# EAGLE design Trace_antenna_final_RFID_v10 (EAGLE 9.6.2)
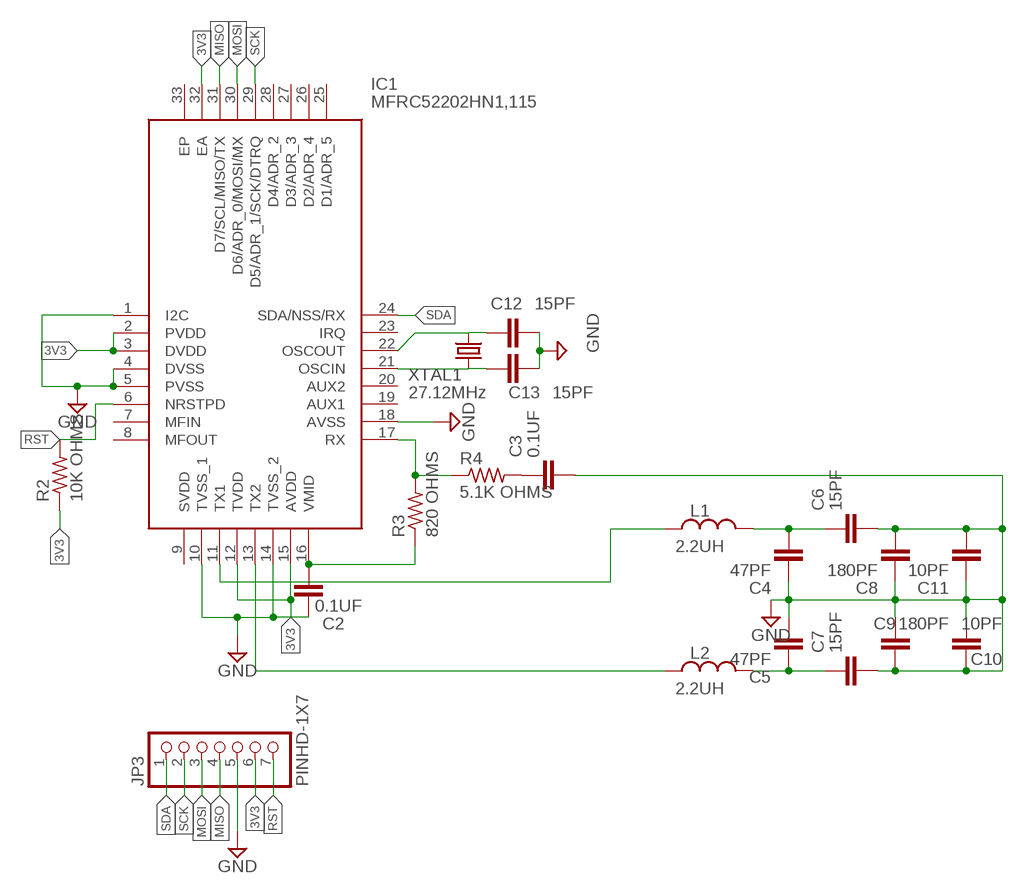
[diagram p0: schematic, sheet 1]

## Parts
C2  0.1UF  C_CHIP-0805(2012-METRIC)  [CAPC2012X110]
C3  0.1UF  C_CHIP-0805(2012-METRIC)  [CAPC2012X110]
C4  47PF  C_CHIP-0805(2012-METRIC)  [CAPC2012X110]
C5  47PF  C_CHIP-0805(2012-METRIC)  [CAPC2012X110]
C6  15PF  C_CHIP-0805(2012-METRIC)  [CAPC2012X110]
C7  15PF  C_CHIP-0805(2012-METRIC)  [CAPC2012X110]
C8  180PF  C_CHIP-0805(2012-METRIC)  [CAPC2012X110]
C9  180PF  C_CHIP-0805(2012-METRIC)  [CAPC2012X110]
C10  10PF  C_CHIP-0805(2012-METRIC)  [CAPC2012X110]
C11  10PF  C_CHIP-0805(2012-METRIC)  [CAPC2012X110]
C12  15PF  C_CHIP-0805(2012-METRIC)  [CAPC2012X110]
C13  15PF  C_CHIP-0805(2012-METRIC)  [CAPC2012X110]
IC1  MFRC52202HN1,115  [QFN50P500X500X100-33N]
JP3  PINHD-1X7  [1X07]
L1  2.2UH  L_CHIP-0805(2012-METRIC)  [INDC2009X120]
L2  2.2UH  L_CHIP-0805(2012-METRIC)  [INDC2009X120]
R2  10K OHMS  R-US_CHIP-0805(2012-METRIC)  [RESC2012X65]
R3  820 OHMS  R-US_CHIP-0805(2012-METRIC)  [RESC2012X65]
R4  5.1K OHMS  R-US_CHIP-0805(2012-METRIC)  [RESC2012X65]
XTAL1  27.12MHz  CRYSTAL_HC49-11.5L  [XTALRR488W45L1150T500H350B]

## Nets
3V3: IC1.2(PVDD) IC1.3(DVDD) IC1.12(TVDD) IC1.15(AVDD) IC1.32(EA) JP3.6 R2.1
GND: C2.1 C3.2 C4.1 C5.2 C6.2 C7.2 C8.1 C8.2 C9.1 C9.2 C10.1 C10.2 C11.1 C11.2 C12.2 C13.2 IC1.1(I2C) IC1.4(DVSS) IC1.5(PVSS) IC1.10(TVSS_1) IC1.14(TVSS_2) IC1.18(AVSS) JP3.5
MISO: IC1.31(D7/SCL/MISO/TX) JP3.4
MOSI: IC1.30(D6/ADR_0/MOSI/MX) JP3.3
N$1: C2.2 IC1.16(VMID) R3.1
N$2: IC1.11(TX1) L1.1
N$3: C12.1 IC1.22(OSCOUT) XTAL1.2
N$4: C13.1 IC1.21(OSCIN) XTAL1.1
N$5: C4.2 C6.1 L1.2
N$6: IC1.17(RX) R3.2 R4.1
N$7: IC1.13(TX2) L2.1
N$8: C5.1 C7.1 L2.2
N$9: C3.1 R4.2
RST: IC1.6(NRSTPD) JP3.7 R2.2
SCK: IC1.29(D5/ADR_1/SCK/DTRQ) JP3.2
SDA: IC1.24(SDA/NSS/RX) JP3.1
Unconnected: IC1.7(MFIN) IC1.8(MFOUT) IC1.9(SVDD) IC1.19(AUX1) IC1.20(AUX2) IC1.23(IRQ) IC1.25(D1/ADR_5) IC1.26(D2/ADR_4) IC1.27(D3/ADR_3) IC1.28(D4/ADR_2) IC1.33(EP)

## Library data of the parts
C2-C13 = Tutorial - Fusion 360:C: Capacitor - Generic; CATEGORY: Capacitor
IC1 = MFRC52202HN1_115:MFRC52202HN1,115: Standard performance MIFARE and NTAG frontend Source: Datasheet <http://www.nxp.com/docs/en/data-sheet/MFRC522.pdf>; DESCRIPTION: Standard performance MIFARE and NTAG frontend; HEIGHT: 1mm; MANUFACTURER_NAME: NXP; MANUFACTURER_PART_NUMBER: MFRC52202HN1,115; MOUSER_PART_NUMBER: 771-MFRC52202HN1115; MOUSER_PRICE-STOCK: https://www.mouser.co.uk/ProductDetail/NXP-Semiconductors/MFRC52202HN1115?qs=cbprxTG2Yq%2F%252BkR%2FEgMbBLA%3D%3D
JP3 = Connector:PINHD-1X7: PIN HEADER; CATEGORY: CONNECTOR; SUB-CATEGORY: PIN-HEADER
L1 L2 = Inductor:L: Inductor Fixed - Generic; CATEGORY: Inductor; SUB-CATEGORY: Fixed
R2-R4 = Tutorial - Fusion 360:R-US: Resistor Fixed - ANSI; CATEGORY: Resistor; SUB-CATEGORY: Fixed
XTAL1 = Frequency-Source:CRYSTAL: Crystal 2Pin - Generic; CATEGORY: Frequency-Source; SUB-CATEGORY: Crystal-2Pin; VALUE: HC49

## Board
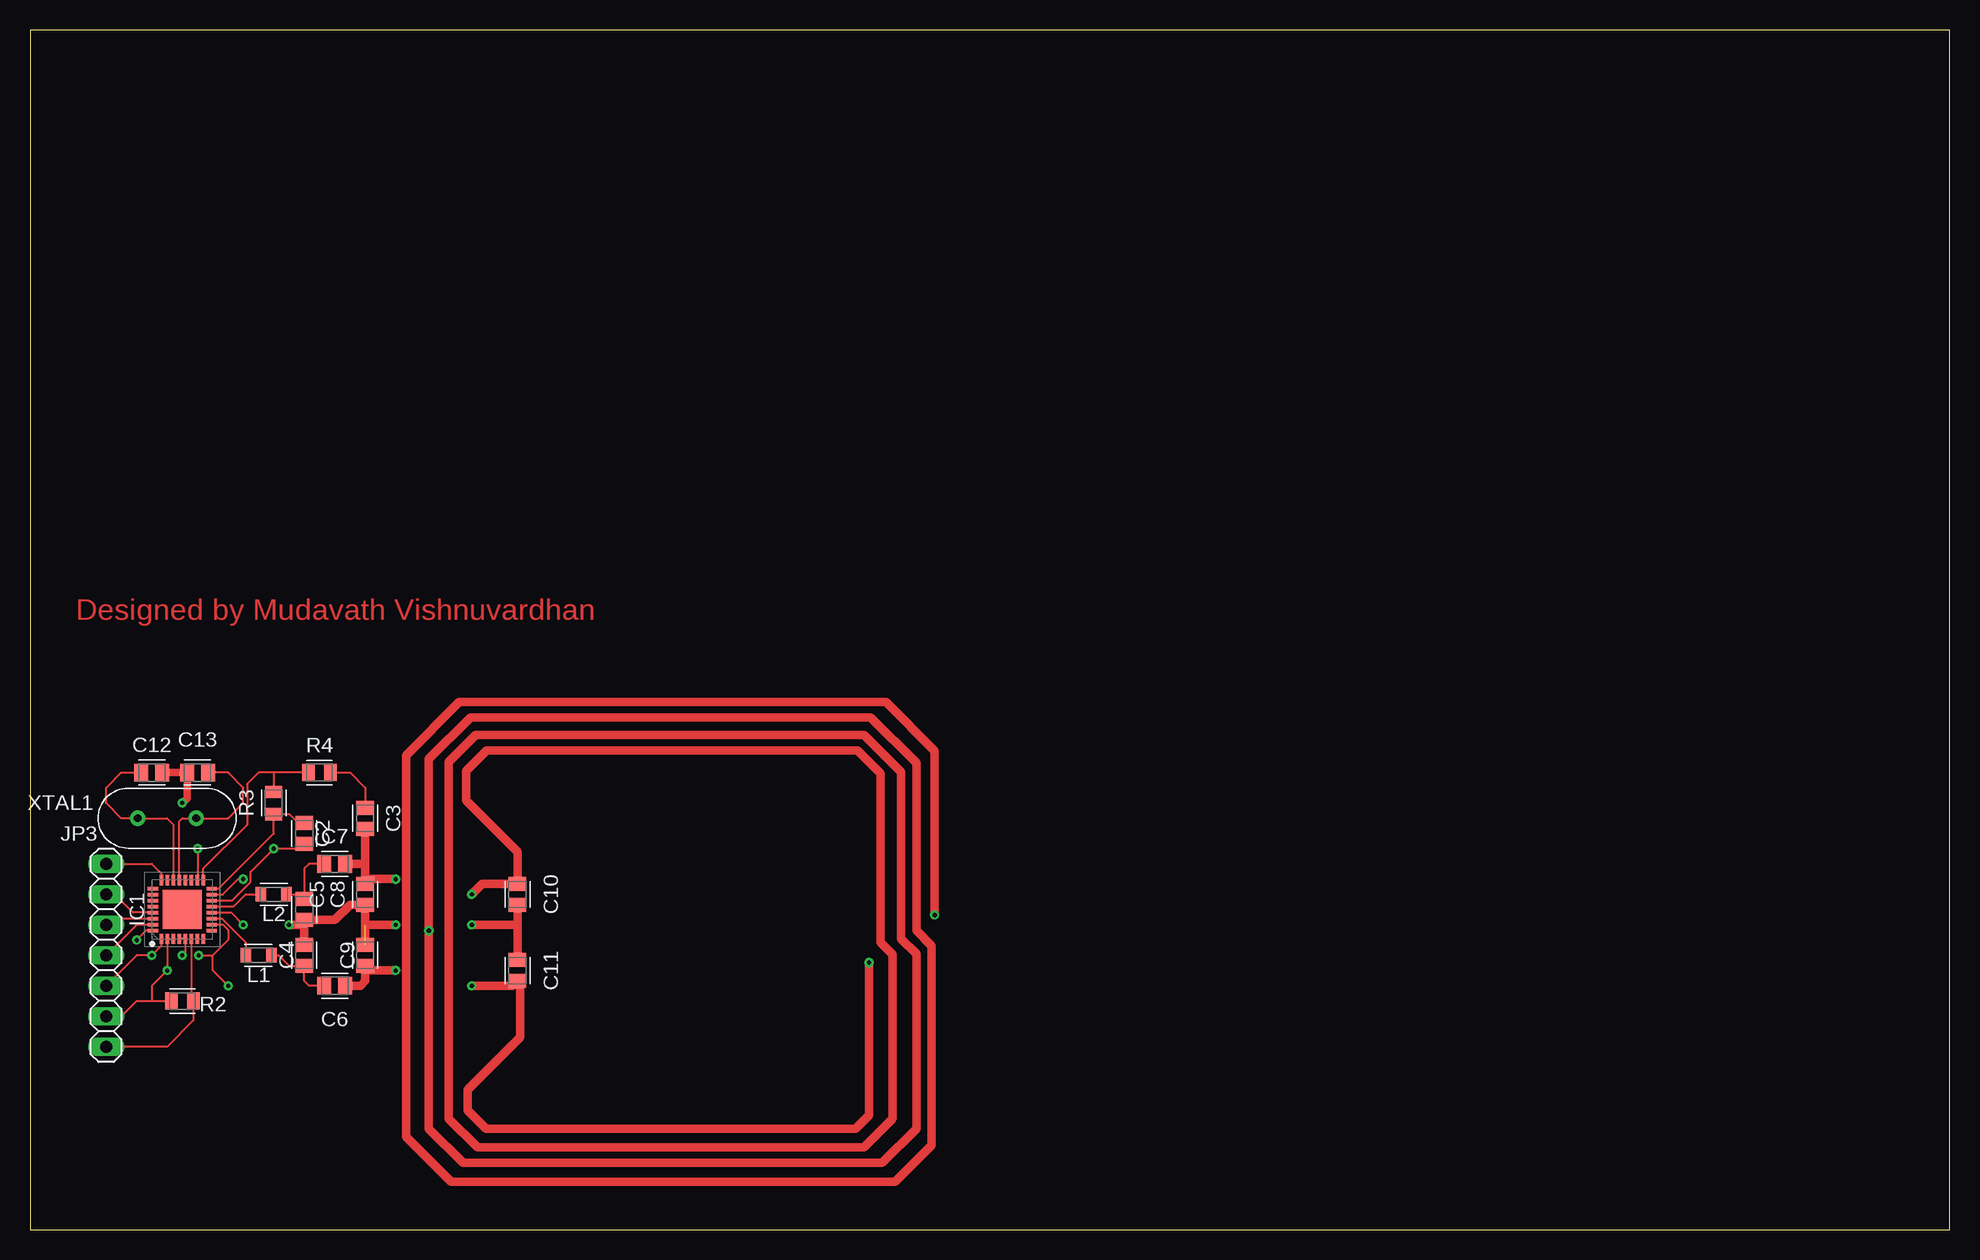
[diagram p1: board, top side]
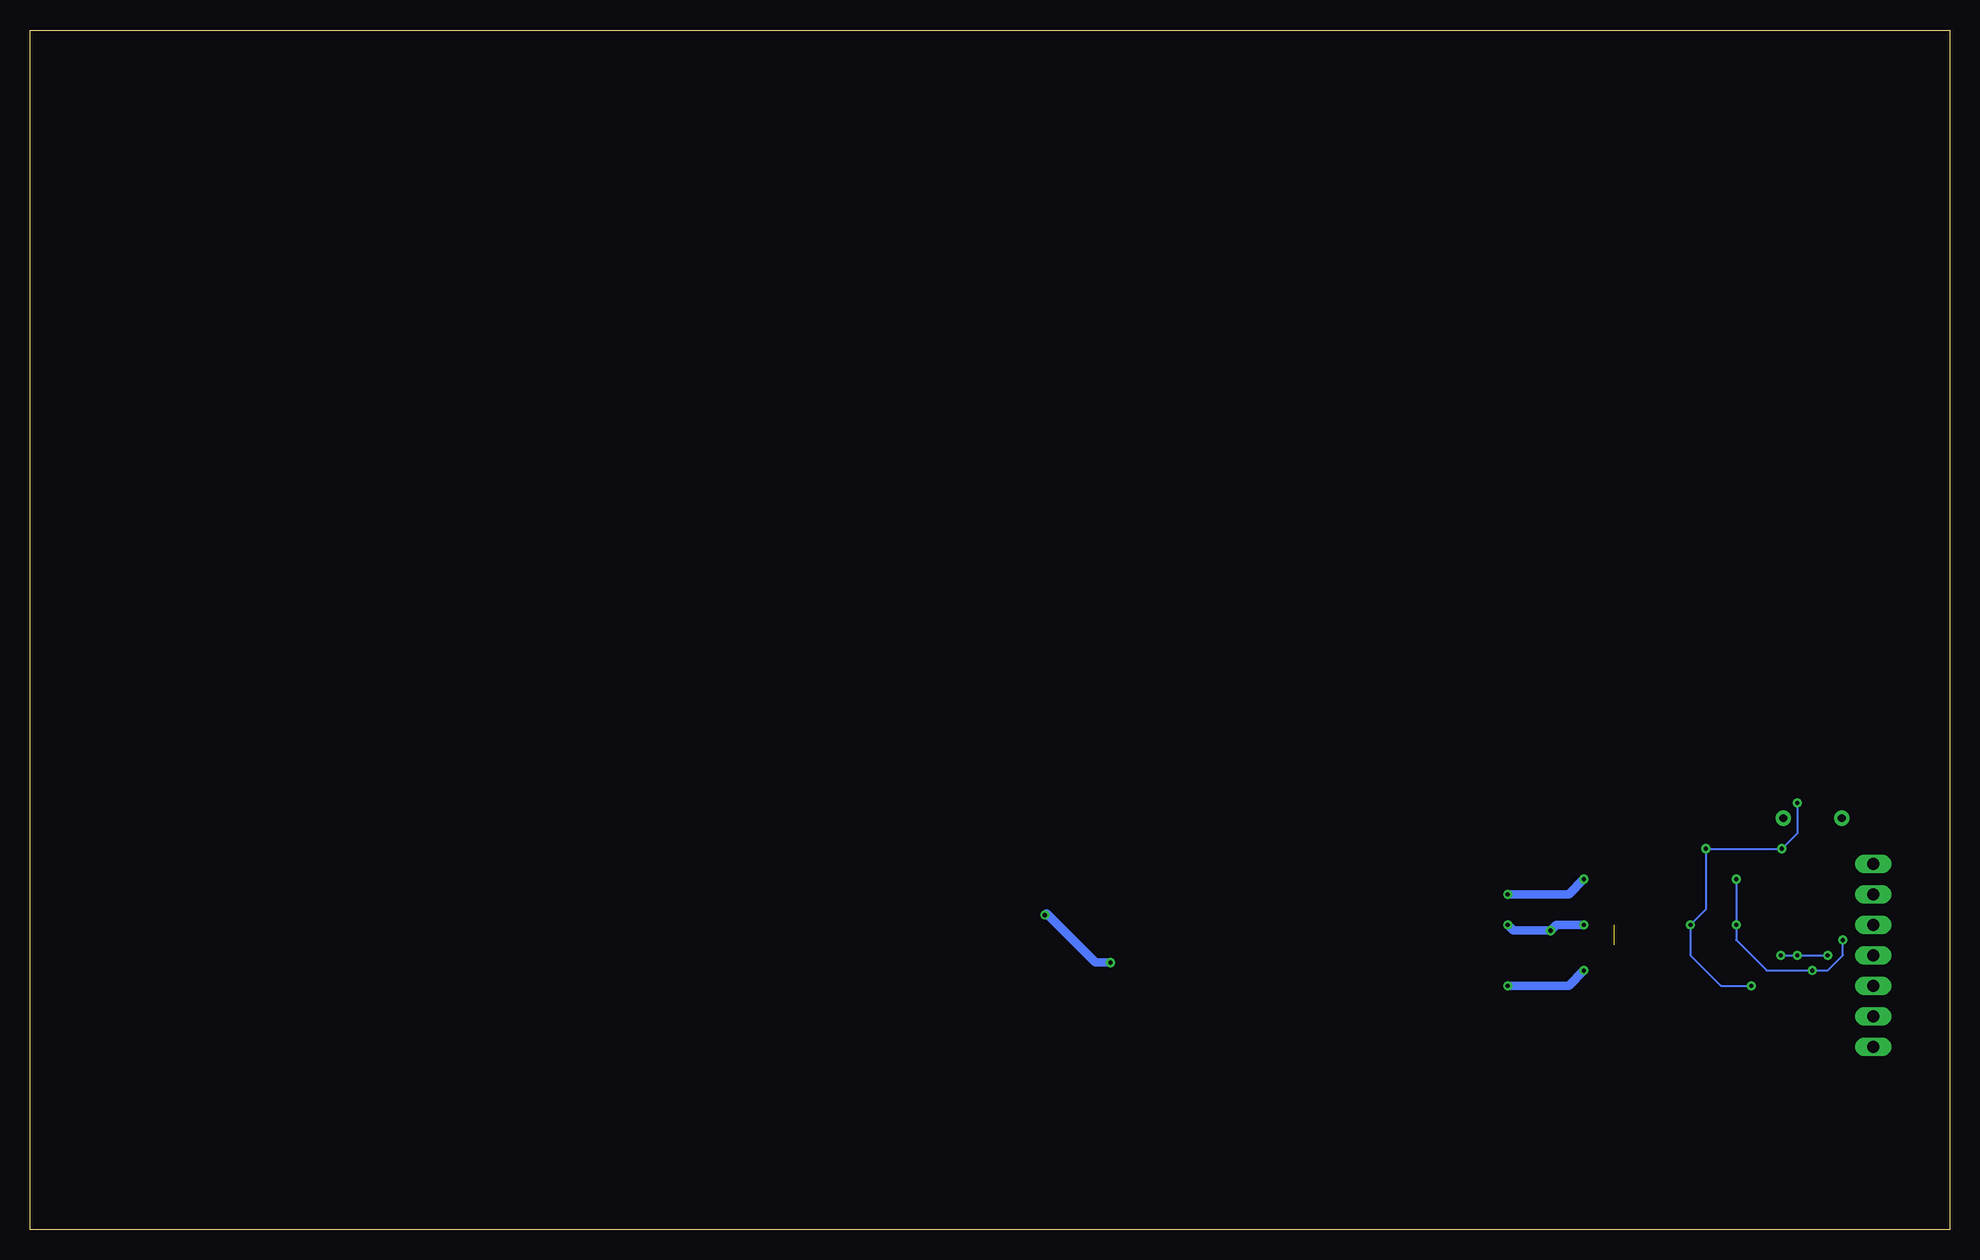
[diagram p2: board, bottom side, seen from below]

Size 160 x 100 mm. Coordinates in mm from the lower left corner, seen from the top.
Outline: 0,0 160,0 160,100 0,100 0,0
Copper layers (1*16): Top 0.035mm / dielectric 1.5mm / Bottom 0.035mm
Design rules "default": minimum track width 6mil, minimum drill 0.35mm, track to track 6mil, track to pad 6mil, pad to pad 6mil, via to via 6mil, smd to smd 6mil, copper to edge 40mil, drill to drill 6mil, minimum pad ring 10mil, minimum via ring 8mil, stop-mask expansion 4mil, vias tented up to drill 0mil, thermal gap 10mil

### Footprints (pad centres in the part's own frame; a part is rotated, then mirrored left to right if it is on the bottom)
CAPC2012X110 = smd 1.165 x 1.465: 1 -0.875,0; 2 0.875,0
QFN50P500X500X100-33N = smd 0.85 x 0.3: 1 -2.45,1.75; 2 -2.45,1.25; 3 -2.45,0.75; 4 -2.45,0.25; 5 -2.45,-0.25; 6 -2.45,-0.75; 7 -2.45,-1.25; 8 -2.45,-1.75; 17 2.45,-1.75; 18 2.45,-1.25; 19 2.45,-0.75; 20 2.45,-0.25; 21 2.45,0.25; 22 2.45,0.75; 23 2.45,1.25; 24 2.45,1.75 | smd 0.3 x 0.85: 9 -1.75,-2.45; 10 -1.25,-2.45; 11 -0.75,-2.45; 12 -0.25,-2.45; 13 0.25,-2.45; 14 0.75,-2.45; 15 1.25,-2.45; 16 1.75,-2.45; 25 1.75,2.45; 26 1.25,2.45; 27 0.75,2.45; 28 0.25,2.45; 29 -0.25,2.45; 30 -0.75,2.45; 31 -1.25,2.45; 32 -1.75,2.45 | smd 3.25 x 3.25: 33 0,0
1X07 = drill 1.016 long: 1 -7.62,0; 2 -5.08,0; 3 -2.54,0; 4 0,0; 5 2.54,0; 6 5.08,0; 7 7.62,0
INDC2009X120 = smd 0.876 x 1.21: 1 -1.067,0; 2 1.067,0
RESC2012X65 = smd 1.031 x 1.42: 1 -0.919,0; 2 0.919,0
XTALRR488W45L1150T500H350B = drill 0.657 pad 1.257: 1 -2.44,0; 2 2.44,0

### Placement (x,y rotation side)
C2  22.86,33.02 90 top
C3  27.94,34.29 270 top
C4  22.86,22.86 270 top
C5  22.86,26.67 270 top
C6  25.4,20.32 0 top
C7  25.4,30.48 0 top
C8  27.94,27.94 90 top
C9  27.94,22.86 270 top
C10  40.64,27.94 90 top
C11  40.64,21.59 90 top
C12  10.16,38.1 0 top
C13  13.97,38.1 180 top
IC1  12.7,26.67 90 top
JP3  6.35,22.86 270 top
L1  19.05,22.86 0 top
L2  20.32,27.94 0 top
R2  12.7,19.05 0 top
R3  20.32,35.56 90 top
R4  24.13,38.1 0 top
XTAL1  11.43,34.29 180 top

### Tracks (layer width: path | path; a pad name or v marks a point on that pad's centre or on a via)
3V3  (via drill 0.35)  (1 unrouted)
  Top 0.152: JP3.6 7.62,17.78 8.89,19.05 10.16,19.05 | IC1.3 11.95,24.13 11.86,24.22 IC1.2 | 11.43,24.2 IC1.2 | IC1.12 16.76,26.42 v17.78,25.4 | IC1.2 11.45,21.61 | 11.43,19.05 R2.1 10.16,19.05 | IC1.32 9.68,24.92 v8.89,24.13 | 10.16,19.05 10.16,20.32 v11.43,21.59 | IC1.15 16.06,27.92 17.35,29.21 v17.78,29.21
  Bottom 0.152: v8.89,24.13 8.89,22.86 10.16,21.59 v11.43,21.59 15.24,21.59 17.78,24.13 v17.78,25.4 v17.78,29.21
GND  (via drill 0.35)  (1 unrouted)
  Top 0.152: JP3.5 8.89,22.86 v10.16,22.86 10.95,23.65 IC1.1 | IC1.4 IC1.5 12.95,23.11 v12.7,22.86 | 13.97,22.86 v14.06,22.86 15.24,22.86 | 15.24,22.86 16.51,24.13 16.51,24.97 16.06,25.42 IC1.10 | v13.97,31.75 13.97,29.14 IC1.18 | C5.2 22.46,25.4 | C7.2 26.67,30.48 | 27.94,29.21 C8.2 | C2.1 22.86,31.75 v20.32,31.75 18.39,29.82 18.39,28.96 16.85,27.42 IC1.14 | v16.51,20.32 15.24,21.59 15.24,22.86
  Top 0.61: C12.2 C13.2 13.1,35.95 v12.7,35.56
  Top 0.7: 22.46,25.4 v21.59,25.4 | C4.1 C5.2 25.4,25.8 26.67,27.07 C8.1 C9.1 | C3.2 27.94,30.48 | 27.94,30.48 27.94,29.21 v30.48,29.21 | C7.2 27.94,30.48 | C6.2 27.55,20.32 27.94,20.71 C9.2 28.34,21.59 v30.48,21.59 | v33.25,24.92 33.25,8.41 36.1,5.55 71.03,5.55 73.89,8.41 73.89,22.96 72.62,24.23 72.62,38.13 69.51,41.24 37.16,41.24 34.91,38.99 34.91,9.24 37.31,6.84 69.51,6.84 71.91,9.24 71.91,22.96 70.91,23.96 70.91,38.01 68.96,39.95 38.07,39.95 36.35,38.23 36.35,35.79 40.64,31.5 C10.2 37.7,28.82 v36.83,27.94 | v33.25,24.92 33.25,39.22 36.73,42.7 70.08,42.7 73.89,38.89 73.89,24.92 75.16,23.65 75.16,7.04 72.11,3.99 35.1,3.99 31.34,7.75 31.34,39.52 35.79,43.97 71.35,43.97 75.41,39.9 v75.41,26.21 | v69.93,22.25 69.93,9.53 68.81,8.41 38.02,8.41 36.5,9.93 36.5,11.66 40.87,16.03 40.87,20.49 C11.1 40.24,20.32 v36.83,20.32 | v30.48,25.4 27.94,25.4 | v36.83,25.4 40.64,25.4 | 40.64,25.4 C10.1 | C11.2 40.64,25.4
  Bottom 0.152: v10.16,22.86 v12.7,22.86 v14.06,22.86 | v12.7,35.56 12.7,33.02 v13.97,31.75 v20.32,31.75 20.32,26.67 v21.59,25.4 21.59,22.86 19.05,20.32 v16.51,20.32
  Bottom 0.7: v30.48,25.4 32.77,25.4 v33.25,24.92 36.35,24.92 v36.83,25.4 | v69.93,22.25 71.2,22.25 75.29,26.34 v75.41,26.21 | v36.83,27.94 31.75,27.94 v30.48,29.21 | v36.83,20.32 31.75,20.32 v30.48,21.59
MISO
  Top 0.152: IC1.31 10.23,25.4 8.89,25.4 JP3.4
MOSI
  Top 0.152: JP3.3 6.87,25.92 IC1.30
N$1
  Top 0.152: C2.2 22.34,33.9 21.59,34.64 R3.1 20.32,33.02 15.72,28.42 IC1.16
N$2
  Top 0.152: L1.1 17.98,23.93 15.99,25.92 IC1.11
N$3
  Top 0.152: C12.1 7.62,38.1 6.35,36.83 6.35,35.56 7.62,34.29 XTAL1.2 11.43,34.29 11.95,33.77 IC1.22
N$4
  Top 0.152: C13.1 16.51,38.1 17.78,36.83 17.78,35.56 16.51,34.29 XTAL1.1 12.7,34.29 12.45,34.04 IC1.21
N$5
  Top 0.152: L1.2 20.71,22.86 21.59,21.98 C4.2 22.86,20.71 23.25,20.32 C6.1
N$6
  Top 0.152: R3.2 20.32,36.83 | R3.2 19.97,36.48 | IC1.17 14.45,30.1 18.09,33.74 18.09,37.13 19.05,38.1 20.32,38.1 | 20.14,36.66 R3.2 | R4.1 20.32,38.1 | 20.32,38.1 R3.2
N$7
  Top 0.152: IC1.13 16.96,26.92 17.98,27.94 L2.1
N$8
  Top 0.152: C5.1 22.86,27.94 | C5.1 22.46,27.94 L2.2 | C7.1 23.25,30.48 22.86,30.09 C5.1
N$9
  Top 0.152: R4.2 26.67,38.1 27.94,36.83 C3.1
RST
  Top 0.152: R2.2 13.97,19.05 | R2.2 13.45,19.05 IC1.6 | R2.2 13.62,17.43 11.43,15.24 JP3.7
SCK
  Top 0.152: IC1.29 8.58,26.42 7.06,27.94 JP3.2
SDA
  Top 0.152: JP3.1 10.16,30.48 10.95,29.69 IC1.24

### Text on the board
Top: Designed by Mudavath Vishnuvardhan